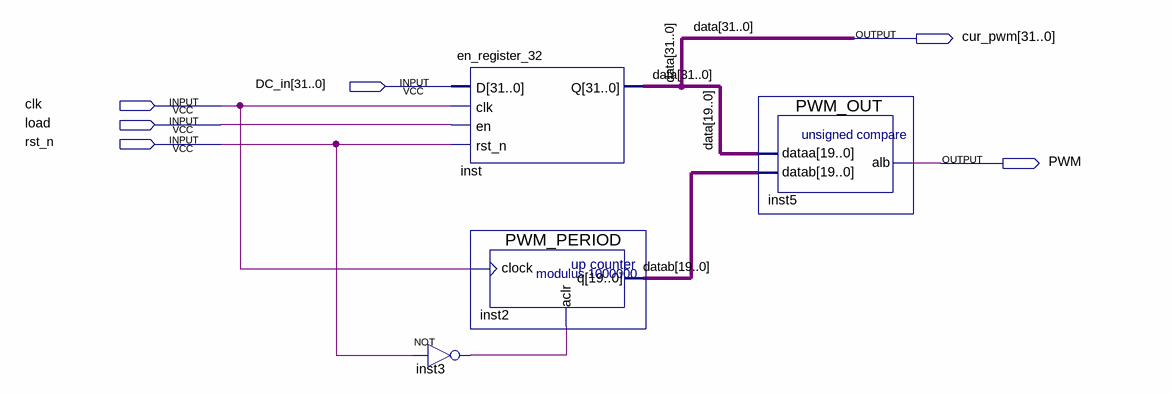
[diagram p0: schematic sheet]
// Quartus schematic PWM.bdf as structural Verilog: 4 symbols, 6 pins
module PWM (
  input  [31:0] DC_in,
  input  clk,
  input  load,
  input  rst_n,
  output [31:0] cur_pwm,
  output PWM
);

  wire inst3_out;
  wire [19:0] datab;

  not inst3 (inst3_out, rst_n);
  en_register_32 inst (.D(DC_in), .clk(clk), .en(load), .rst_n(rst_n), .Q(cur_pwm));
  PWM_PERIOD inst2 (.clock(clk), .aclr(inst3_out), .q(datab));
  PWM_OUT inst5 (.dataa(cur_pwm[19:0]), .datab(datab), .alb(PWM));

  // Other names for the same wires on the sheet: data[31:0] = cur_pwm
endmodule
